# EAGLE design atmega32-mame (EAGLE 7.6.0)
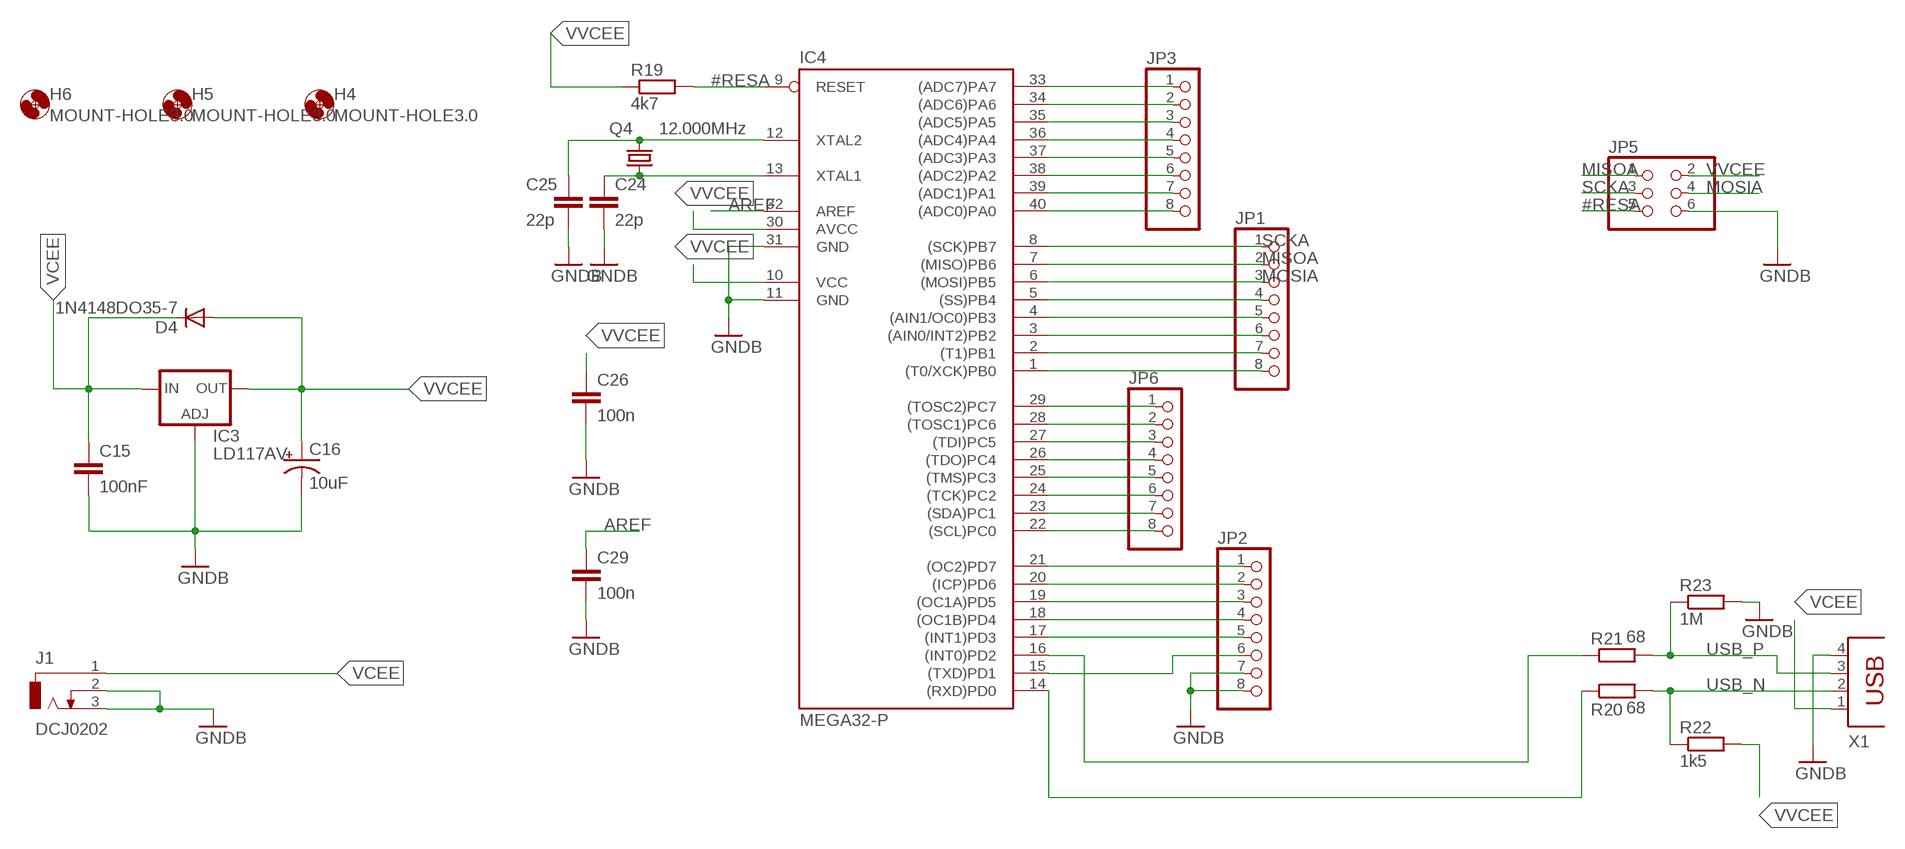
[diagram p0: schematic, sheet 1]

## Parts
C15  100nF  C-EU025-025X050  [C025-025X050]
C16  10uF  CPOL-USE2,5-6E  [E2,5-6E]
C24  22p  C2.5/2  [C2.5-2]
C25  22p  C2.5/2  [C2.5-2]
C26  100n  C5/2.5  [C5B2.5]
C29  100n  C5/2.5  [C5B2.5]
D4  1N4148DO35-7  [DO35-7]
H4  MOUNT-HOLE3.0  [3,0]
H5  MOUNT-HOLE3.0  [3,0]
H6  MOUNT-HOLE3.0  [3,0]
IC3  LD117AV  [TO220L1]
IC4  MEGA32-P  [DIL40]
J1  DCJ0202  [DCJ0202]
JP1  PINHD-1X8  [1X08]
JP2  PINHD-1X8  [1X08]
JP3  PINHD-1X8  [1X08]
JP5  PINHD-2X3  [2X03]
JP6  PINHD-1X8  [1X08]
Q4  12.000MHz  CRYSTALHC18U-V  [HC18U-V]
R19  4k7  R-EU_0207/10  [0207/10]
R20  68  R-EU_0207/10  [0207/10]
R21  68  R-EU_0207/10  [0207/10]
R22  1k5  R-EU_0207/10  [0207/10]
R23  1M  R-EU_0207/10  [0207/10]
X1  PN61729  [PN61729]

## Nets
#RESA: IC4.9(RESET) JP5.5 R19.2
AREF: C29.1 IC4.32(AREF)
GND: C15.2 C16.- C24.2 C25.2 C26.2 C29.2 IC3.1(ADJ) IC4.11(GND) IC4.31(GND) J1.2 J1.3 JP2.7 JP2.8 JP5.6 R23.2 X1.4 ; supply symbol labelled GNDB
MISOA: IC4.7((MISO)PB6) JP1.2 JP5.1
MOSIA: IC4.6((MOSI)PB5) JP1.3 JP5.4
N$1: IC4.15((TXD)PD1) JP2.6
N$23: IC4.16((INT0)PD2) R21.1
N$25: IC4.14((RXD)PD0) R20.1
N$45: C24.1 IC4.13(XTAL1) Q4.1
N$46: C25.1 IC4.12(XTAL2) Q4.2
N$49: IC4.21((OC2)PD7) JP2.1
N$50: IC4.22((SCL)PC0) JP6.8
N$51: IC4.23((SDA)PC1) JP6.7
N$52: IC4.24((TCK)PC2) JP6.6
N$53: IC4.25((TMS)PC3) JP6.5
N$54: IC4.26((TDO)PC4) JP6.4
N$55: IC4.27((TDI)PC5) JP6.3
N$56: IC4.28((TOSC1)PC6) JP6.2
N$57: IC4.29((TOSC2)PC7) JP6.1
N$58: IC4.33((ADC7)PA7) JP3.1
N$59: IC4.34((ADC6)PA6) JP3.2
N$60: IC4.35((ADC5)PA5) JP3.3
N$61: IC4.36((ADC4)PA4) JP3.4
N$62: IC4.37((ADC3)PA3) JP3.5
N$63: IC4.38((ADC2)PA2) JP3.6
N$64: IC4.39((ADC1)PA1) JP3.7
N$65: IC4.40((ADC0)PA0) JP3.8
N$67: IC4.17((INT1)PD3) JP2.5
N$68: IC4.18((OC1B)PD4) JP2.4
N$69: IC4.19((OC1A)PD5) JP2.3
N$70: IC4.20((ICP)PD6) JP2.2
N$71: IC4.2((T1)PB1) JP1.7
N$72: IC4.3((AIN0/INT2)PB2) JP1.6
N$73: IC4.5((SS)PB4) JP1.4
N$74: IC4.4((AIN1/OC0)PB3) JP1.5
N$75: IC4.1((T0/XCK)PB0) JP1.8
SCKA: IC4.8((SCK)PB7) JP1.1 JP5.3
USB_N: R20.2 R22.1 X1.2
USB_P: R21.2 R23.1 X1.3
VCEE: C15.1 D4.C IC3.3(IN) J1.1 X1.1
VVCEE: C16.+ C26.1 D4.A IC3.2(OUT) IC4.10(VCC) IC4.30(AVCC) JP5.2 R19.1 R22.2

## Library data of the parts
C15 = rcl:C-EU: CAPACITOR, European symbol
C16 = rcl:CPOL-US: POLARIZED CAPACITOR, American symbol
C24-C26 C29 = capacitor-wima:C: CAPACITOR naming: grid - package width
D4 = diode:1N4148: DIODE high speed (Philips)
H4-H6 = holes:MOUNT-HOLE: MOUNTING HOLE with drill center marker
IC3 = v-reg:LD117A?*: Low drop fixed and adjustable positive voltage regulators 1 A Source: http://www.st.com/stonline/products/literature/ds/7194/ld1117axx.pdf
IC4 = atmel:MEGA32-P: MICROCONTROLLER 32 Kbytes FLASH 2 Kbytes SRAM 1 Kbytes EEPROM USART 8-channel 10 bit ADC Source: www.atmel.com .. doc2503.pdf
J1 = con-jack:DCJ0202: DC POWER JACK Source: DCJ0202.pdf; OC_FARNELL: unknown; OC_NEWARK: unknown
JP1-JP3 JP6 = pinhead:PINHD-1X8: PIN HEADER
JP5 = pinhead:PINHD-2X3: PIN HEADER
Q4 = crystal:CRYSTAL: CRYSTAL
R19-R23 = resistor:R-EU_: RESISTOR, European symbol
X1 = con-berg:PN61729: BERG USB connector

## Board
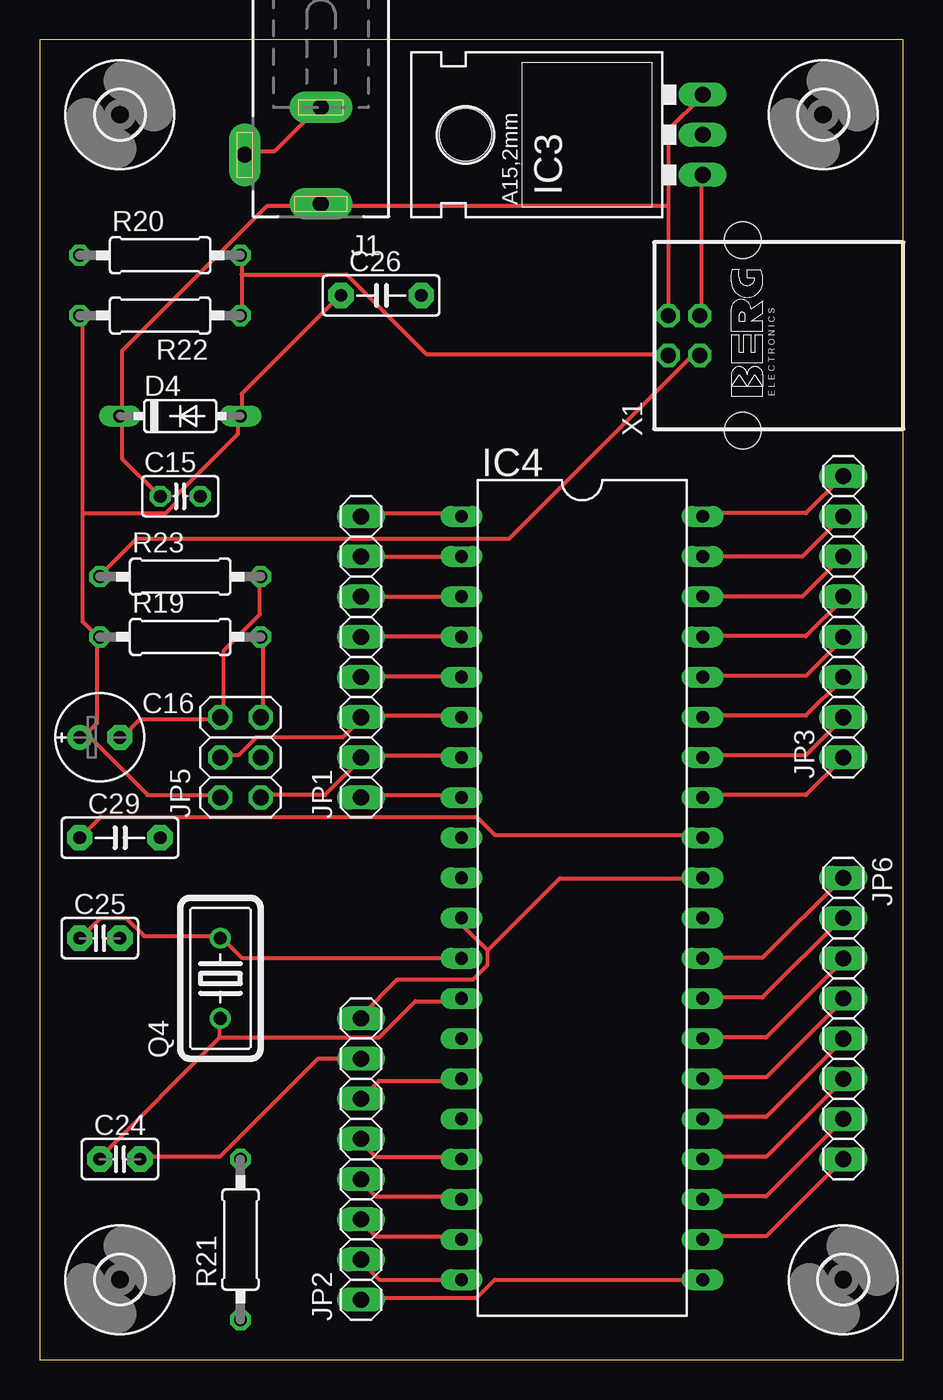
[diagram p1: board, top side]
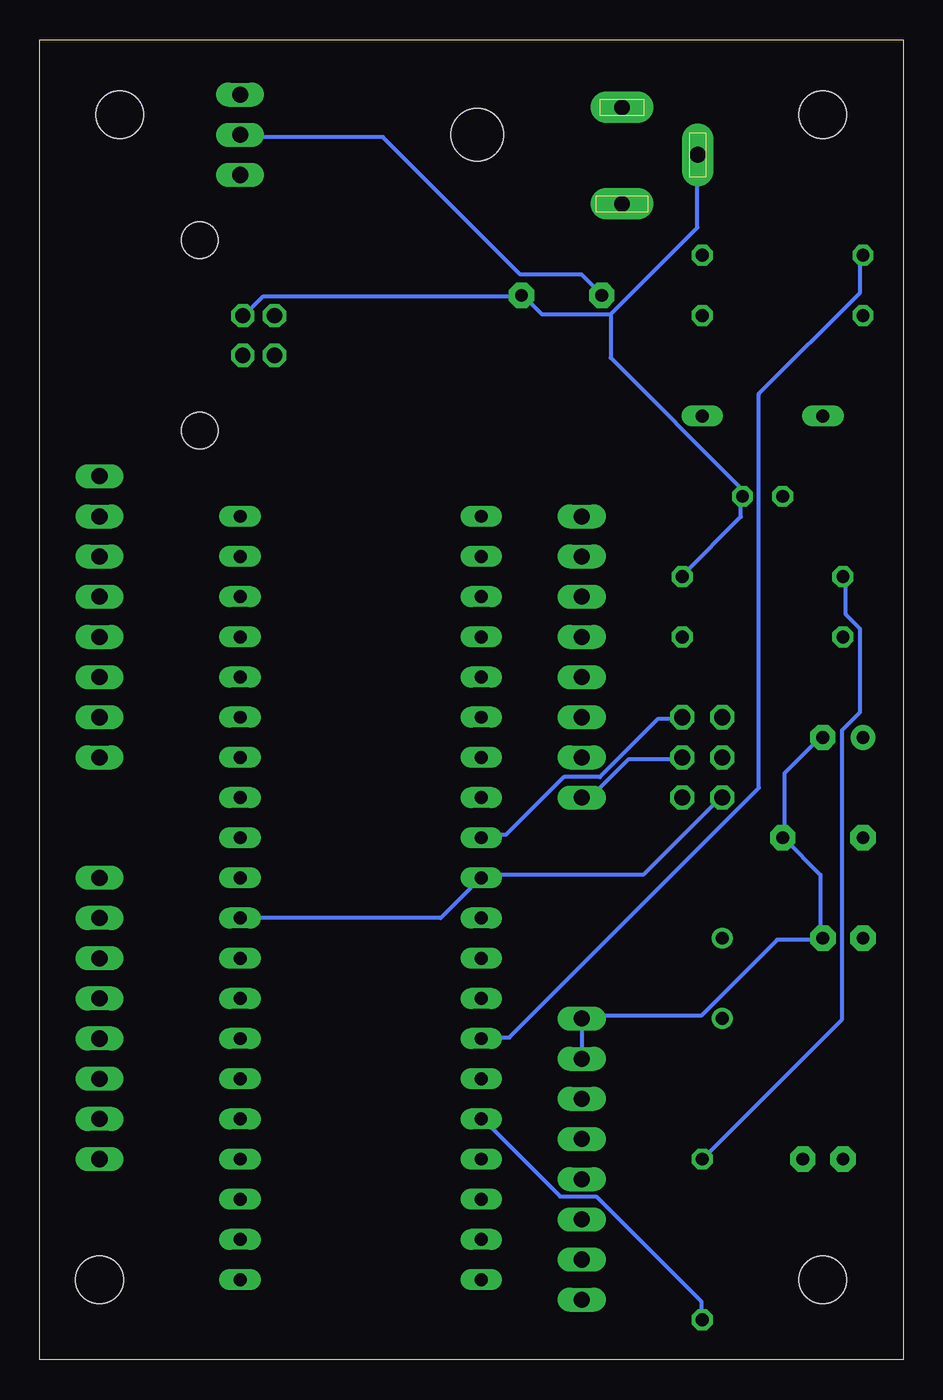
[diagram p2: board, bottom side, seen from below]

Size 54.59 x 83.49 mm. Coordinates in mm from the lower left corner, seen from the top.
Outline: 0,0 54.59,0 54.59,83.49 0,83.49 0,0
Copper layers (1*16): Top 0.035mm / dielectric 1.5mm / Bottom 0.035mm
Design rules "default": minimum track width 10mil, minimum drill 24mil, track to track 8mil, track to pad 8mil, pad to pad 8mil, via to via 8mil, smd to smd 8mil, copper to edge 40mil, drill to drill 8mil, minimum pad ring 10mil, minimum via ring 8mil, stop-mask expansion 4mil, vias tented up to drill 0mil, thermal gap 10mil

### Footprints (pad centres in the part's own frame; a part is rotated, then mirrored left to right if it is on the bottom)
C025-025X050 = drill 0.813 octagon: 1 -1.27,0; 2 1.27,0
E2,5-6E = drill 0.813 pad 1.575: + -1.27,0 | drill 0.813 pad 1.575 octagon: - 1.27,0
C2.5-2 = drill 0.813 pad 1.6 octagon: 1 -1.27,0; 2 1.27,0
C5B2.5 = drill 0.813 pad 1.6 octagon: 1 -2.54,0; 2 2.54,0
DO35-7 = drill 0.813 long: A 3.81,0; C -3.81,0
3,0 = hole 3: 0,0
TO220L1 = drill 1.016 long: 1 -2.54,-3.81; 2 0,-3.81; 3 2.54,-3.81 | hole 3.302: 0,11.176
DIL40 = drill 0.813 long: 1 -24.13,-7.62; 2 -21.59,-7.62; 3 -19.05,-7.62; 4 -16.51,-7.62; 5 -13.97,-7.62; 6 -11.43,-7.62; 7 -8.89,-7.62; 8 -6.35,-7.62; 9 -3.81,-7.62; 10 -1.27,-7.62; 11 1.27,-7.62; 12 3.81,-7.62; 13 6.35,-7.62; 14 8.89,-7.62; 15 11.43,-7.62; 16 13.97,-7.62; 17 16.51,-7.62; 18 19.05,-7.62; 19 21.59,-7.62; 20 24.13,-7.62; 21 24.13,7.62; 22 21.59,7.62; 23 19.05,7.62; 24 16.51,7.62; 25 13.97,7.62; 26 11.43,7.62; 27 8.89,7.62; 28 6.35,7.62; 29 3.81,7.62; 30 1.27,7.62; 31 -1.27,7.62; 32 -3.81,7.62; 33 -6.35,7.62; 34 -8.89,7.62; 35 -11.43,7.62; 36 -13.97,7.62; 37 -16.51,7.62; 38 -19.05,7.62; 39 -21.59,7.62; 40 -24.13,7.62
DCJ0202 = drill 1 pad 2 long: 1 0,3.1; 2 4.8,0; 3 0,-3
1X08 = drill 1.016 long: 1 -8.89,0; 2 -6.35,0; 3 -3.81,0; 4 -1.27,0; 5 1.27,0; 6 3.81,0; 7 6.35,0; 8 8.89,0
2X03 = drill 1.016 octagon: 1 -2.54,-1.27; 2 -2.54,1.27; 3 0,-1.27; 4 0,1.27; 5 2.54,-1.27; 6 2.54,1.27
HC18U-V = drill 0.813: 1 -2.54,0; 2 2.54,0
0207/10 = drill 0.813 octagon: 1 -5.08,0; 2 5.08,0
PN61729 = drill 0.95 octagon: 1 1.25,4.71; 2 -1.25,4.71; 3 -1.25,2.71; 4 1.25,2.71 | hole 2.3: -6.02,0; 6.02,0

### Placement (x,y rotation side)
C15  8.89,54.61 0 top
C16  3.81,39.37 0 top
C24  5.08,12.7 0 top
C25  3.81,26.67 0 top
C26  21.59,67.31 0 top
C29  5.08,33.02 0 top
D4  8.89,59.69 0 top
H1  MOUNT-HOLE3.0  [3,0]  5.08,78.74 0 top
H4  49.53,78.74 0 top
H5  5.08,5.08 0 top
H6  50.8,5.08 0 top
IC3  38.1,77.47 90 top
IC4  34.29,29.21 270 top
J1  17.78,76.2 180 top
JP1  20.32,44.45 90 top
JP2  20.32,12.7 90 top
JP3  50.8,46.99 90 top
JP5  12.7,38.1 90 top
JP6  50.8,21.59 270 top
Q4  11.43,24.13 90 top
R19  8.89,45.72 0 top
R20  7.62,69.85 0 top
R21  12.7,7.62 90 top
R22  7.62,66.04 180 top
R23  8.89,49.53 0 top
X1  44.45,64.77 90 top

### Tracks (layer width: path | path; a pad name or v marks a point on that pad's centre or on a via)
#RESA
  Top 0.254: R19.2 14.15,45.54 14.15,40.74 JP5.5
  Bottom 0.254: IC4.9 26.49,33.2 25.12,33.2 21.46,36.85 19.18,36.85 15.52,40.51 14.15,40.51 JP5.5
AREF
  Top 0.254: C29.1 3.86,34.34 27.63,34.34 28.78,33.2 41.81,33.2 IC4.32
GND
  Top 0.254: 28.32,25.88 26.72,27.48 26.72,27.94 IC4.11 | 28.32,25.88 28.32,24.97 27.41,24.05 22.61,24.05 20.32,21.77 JP2.8 | 28.32,25.88 32.89,30.45 41.81,30.45 IC4.31 | C24.2 6.38,12.85 11.41,12.85 17.58,19.02 20.32,19.02 JP2.7 | C16.- 5.23,39.37 6.38,40.51 11.41,40.51 JP5.6 11.63,40.74 11.63,44.86 13.92,47.14 13.92,49.43 R23.2 | J1.2 13.01,76.4 14.83,76.4 17.58,79.15 J1.3 | X1.4 41.81,66.12 41.81,74.8 IC3.1
  Bottom 0.254: JP2.7 JP2.8 20.32,21.77 12.78,21.77 7.98,26.57 5.23,26.57 C25.2 5.23,26.8 5.23,30.68 7.52,32.97 C29.2 7.52,33.2 7.52,37.08 5.23,39.37 C16.- | R23.2 13.92,49.66 10.26,53.31 10.26,54.46 C15.2 10.26,54.69 10.26,55.14 18.49,63.37 18.49,66.12 | X1.4 41.58,66.12 40.44,67.26 24.21,67.26 C26.2 23.98,67.26 22.84,66.12 18.49,66.12 | 18.49,66.12 13.01,71.6 13.01,76.17 J1.2
MISOA
  Top 0.254: IC4.7 26.49,38.23 20.32,38.23 JP1.2 20.32,38 18.03,35.71 14.15,35.71 JP5.1
MOSIA
  Top 0.254: IC4.6 26.49,40.74 20.32,40.74 JP1.3 20.32,40.51 19.18,39.37 13.69,39.37 12.55,38.23 11.63,38.23 JP5.4
N$1
  Top 0.254: JP2.6 21.46,17.65 26.49,17.65 IC4.15
N$23
  Bottom 0.254: R21.1 12.78,2.56 12.78,3.71 19.41,10.34 21.69,10.34 26.49,15.14 IC4.16
N$25
  Bottom 0.254: R20.1 2.72,69.77 2.72,67.49 9.12,61.09 9.12,36.17 24.89,20.4 26.49,20.4 IC4.14
N$45
  Top 0.254: 11.41,20.4 11.41,21.54 Q4.1 | 11.41,20.4 3.86,12.85 C24.1 | 11.41,20.4 21.46,20.4 23.75,22.68 26.49,22.68 IC4.13
N$46
  Top 0.254: C25.1 2.72,26.8 3.86,27.94 5.46,27.94 6.6,26.8 11.41,26.8 Q4.2 11.63,26.57 12.78,25.42 26.49,25.42 IC4.12
N$49
  Top 0.254: IC4.21 28.78,5.08 27.63,3.94 20.32,3.94 JP2.1
N$50
  Top 0.254: JP6.8 45.92,7.82 42.04,7.82 IC4.22
N$51
  Top 0.254: IC4.23 42.04,10.34 45.92,10.34 50.72,15.14 JP6.7
N$52
  Top 0.254: IC4.24 42.04,12.85 45.92,12.85 50.72,17.65 JP6.6
N$53
  Top 0.254: IC4.25 42.04,15.37 45.92,15.37 50.72,20.17 JP6.5
N$54
  Top 0.254: IC4.26 42.04,17.88 45.92,17.88 50.72,22.68 JP6.4
N$55
  Top 0.254: IC4.27 42.04,20.4 45.92,20.4 50.72,25.2 JP6.3
N$56
  Top 0.254: IC4.28 42.04,22.91 45.7,22.91 50.72,27.94 JP6.2
N$57
  Top 0.254: IC4.29 42.04,25.42 45.7,25.42 50.72,30.45 JP6.1
N$58
  Top 0.254: IC4.33 42.04,35.71 48.44,35.71 50.72,38 JP3.1
N$59
  Top 0.254: IC4.34 42.04,38.23 48.44,38.23 50.72,40.51 JP3.2
N$60
  Top 0.254: IC4.35 42.04,40.74 48.44,40.74 50.72,43.03 JP3.3
N$61
  Top 0.254: IC4.36 42.04,43.26 48.44,43.26 50.72,45.54 JP3.4
N$62
  Top 0.254: IC4.37 42.04,45.77 48.44,45.77 50.72,48.06 JP3.5
N$63
  Top 0.254: IC4.38 42.04,48.28 48.21,48.28 50.72,50.8 JP3.6
N$64
  Top 0.254: IC4.39 48.21,50.8 50.72,53.31 JP3.7
N$65
  Top 0.254: IC4.40 42.04,53.54 48.44,53.54 50.72,55.83 JP3.8
N$67
  Top 0.254: IC4.17 26.49,12.85 21.23,12.85 20.32,13.77 JP2.5
N$68
  Top 0.254: IC4.18 26.49,10.34 21.23,10.34 20.32,11.25 JP2.4
N$69
  Top 0.254: IC4.19 26.49,7.82 21.23,7.82 20.32,8.74 JP2.3
N$70
  Top 0.254: IC4.20 21.46,5.08 20.32,6.22 JP2.2
N$71
  Top 0.254: JP1.7 IC4.2
N$72
  Top 0.254: IC4.3 26.49,48.28 20.32,48.28 JP1.6
N$73
  Top 0.254: IC4.5 26.49,43.26 20.32,43.26 JP1.4
N$74
  Top 0.254: IC4.4 26.49,45.77 20.32,45.77 JP1.5
N$75
  Top 0.254: IC4.1 26.49,53.54 20.32,53.54 JP1.8
SCKA
  Top 0.254: IC4.8 26.49,35.71 20.32,35.71 JP1.1
  Bottom 0.254: JP5.3 14.15,38 17.35,38 19.63,35.71 20.32,35.71 JP1.1
USB_N
  Top 0.254: 12.78,68.63 12.78,69.77 R20.2 | 12.78,68.63 12.78,66.12 R22.1 | 12.78,68.63 19.41,68.63 24.44,63.6 39.52,63.6 X1.2
USB_P
  Top 0.254: X1.3 41.58,63.37 41.12,63.37 29.69,51.94 6.15,51.94 3.86,49.66 R23.1
  Bottom 0.254: R21.2 3.86,21.54 3.86,39.83 2.72,40.97 2.72,46.23 3.63,47.14 3.63,49.43 R23.1
VCEE
  Top 0.254: 39.75,72.97 39.75,77.78 41.81,79.83 IC3.3 | 39.75,72.97 39.75,66.12 X1.1 | C15.1 7.52,54.69 5.23,56.97 5.23,59.49 D4.C 5.23,59.72 5.23,63.83 14.38,72.97 17.58,72.97 J1.1 17.8,72.97 39.75,72.97
VVCEE
  Top 0.254: C26.1 18.95,67.26 12.78,61.09 12.78,59.72 D4.A 12.55,59.49 12.55,58.57 8.66,54.69 8.66,54.23 7.98,53.54 2.72,53.54 | 2.95,39.6 2.72,39.37 C16.+ 2.95,39.6 | 2.95,39.6 3.63,40.28 3.63,45.54 R19.1 3.63,45.77 2.72,46.69 2.72,53.54 | 2.72,53.54 2.72,65.89 R22.2 | 2.95,39.6 6.83,35.71 11.41,35.71 JP5.2
  Bottom 0.254: IC3.2 41.81,77.32 32.89,77.32 24.21,68.63 20.32,68.63 19.18,67.49 C26.1 | IC4.30 29.23,27.94 26.72,30.45 IC4.10 26.49,30.68 16.43,30.68 11.63,35.48 JP5.2